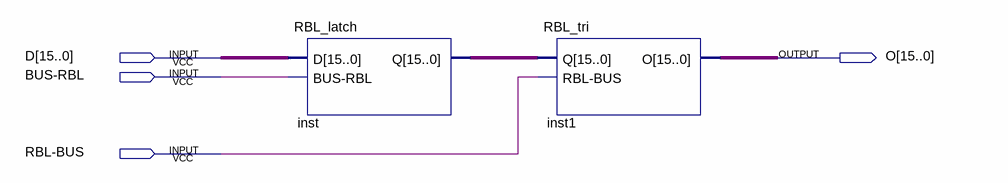
[diagram p0: schematic sheet]
// Quartus schematic RBL.bdf as structural Verilog: 2 symbols, 4 pins
module RBL (
  input  [15:0] D,
  input  \BUS-RBL ,
  input  \RBL-BUS ,
  output [15:0] O
);

  wire [15:0] inst_q;

  RBL_latch inst (.D(D), .\BUS-RBL (\BUS-RBL ), .Q(inst_q));
  RBL_tri inst1 (.Q(inst_q), .\RBL-BUS (\RBL-BUS ), .O(O));
endmodule
